# Altium schematic sheet Block Diagram.SchDoc
size 420 x 297 mm; DrawnBy: Süleyman ARIKAYA; Revision: AA; SheetNumber: 2; SheetTotal: 5
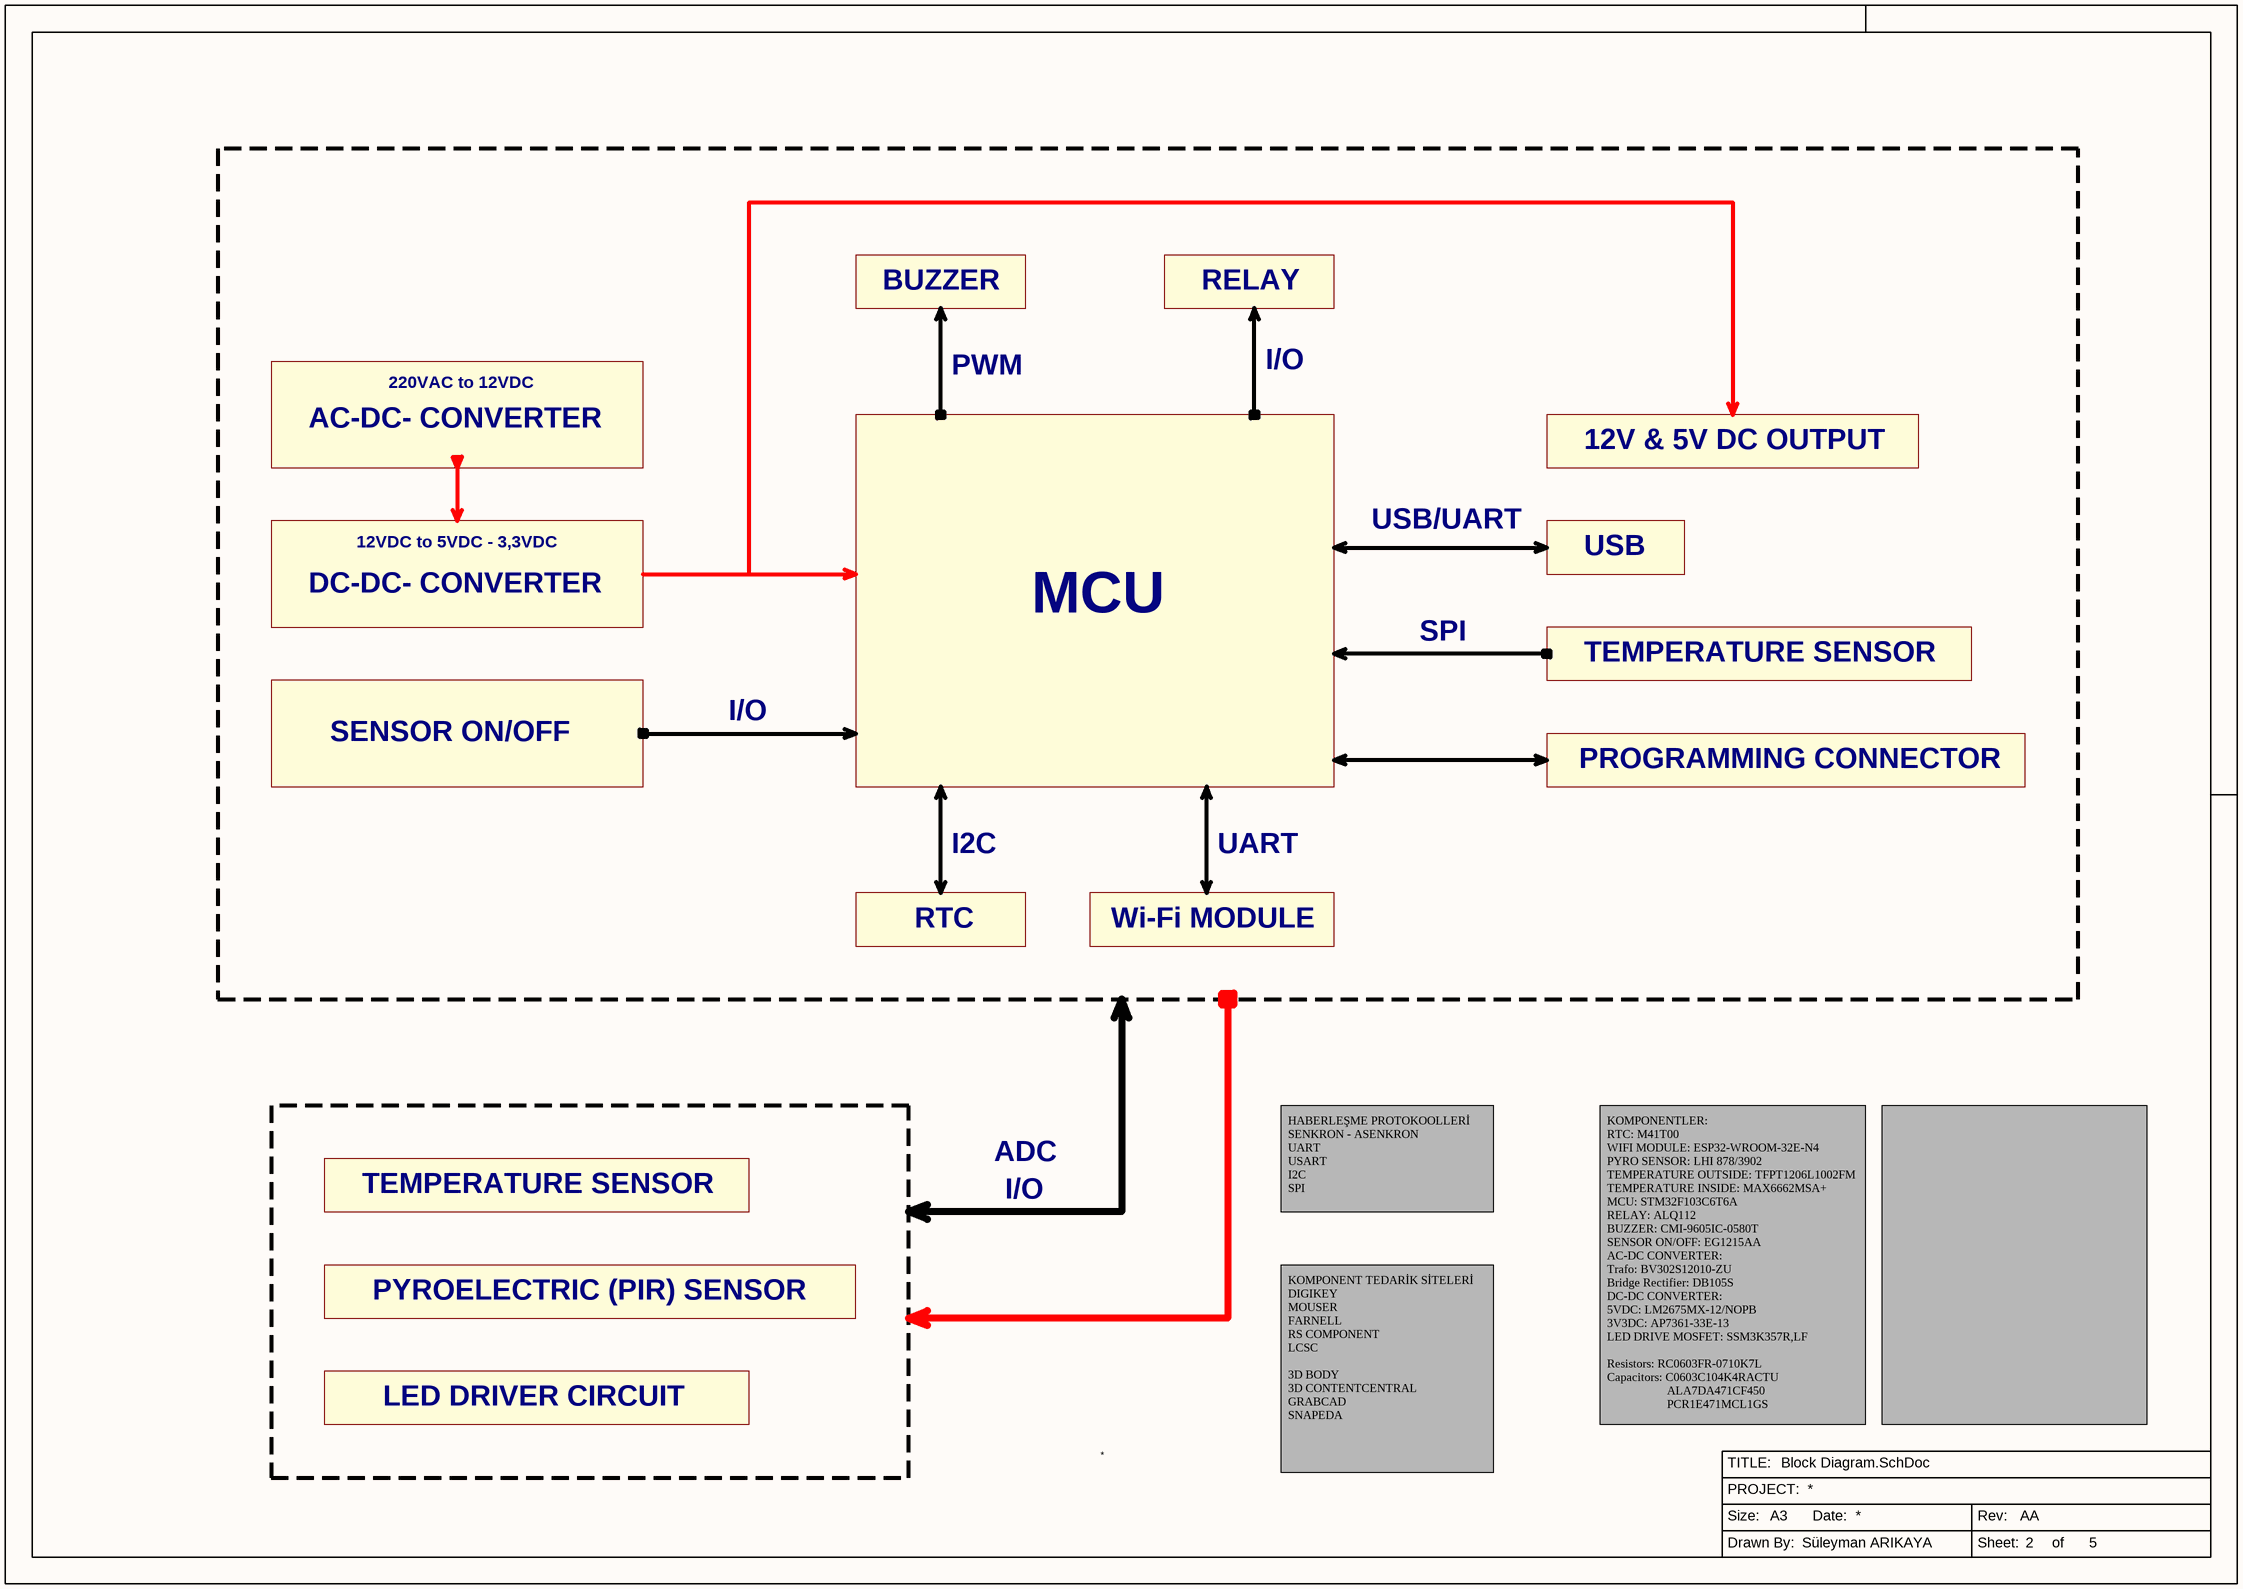
[diagram p0: Block Diagram.SchDoc]

## Notes on the sheet
- BUZZER
- RELAY
- 220VAC to 12VDC
- PWM
- I/O
- AC-DC- CONVERTER
- 12V & 5V DC OUTPUT
- USB/UART
- DC-DC- CONVERTER
- 12VDC to 5VDC - 3,3VDC
- USB
- MCU
- SPI
- TEMPERATURE SENSOR
- SENSOR ON/OFF
- PROGRAMMING CONNECTOR
- I2C
- UART
- RTC
- Wi-Fi MODULE
- ADC
- HABERLEŞME PROTOKOOLLERİ
  SENKRON - ASENKRON
  UART
  USART
  I2C
  SPI
- PYROELECTRIC (PIR) SENSOR
- LED DRIVER CIRCUIT
- KOMPONENT TEDARİK SİTELERİ
  DIGIKEY
  MOUSER
  FARNELL
  RS COMPONENT
  LCSC
  3D BODY
  3D CONTENTCENTRAL
  GRABCAD
  SNAPEDA
- KOMPONENTLER:
  RTC: M41T00
  WIFI MODULE: ESP32-WROOM-32E-N4
  PYRO SENSOR: LHI 878/3902
  TEMPERATURE OUTSIDE: TFPT1206L1002FM
  TEMPERATURE INSIDE: MAX6662MSA+
  MCU: STM32F103C6T6A
  RELAY: ALQ112
  BUZZER: CMI-9605IC-0580T
  SENSOR ON/OFF: EG1215AA
  AC-DC CONVERTER:
  Trafo: BV302S12010-ZU
  Bridge Rectifier: DB105S
  DC-DC CONVERTER:
  5VDC: LM2675MX-12/NOPB
  3V3DC: AP7361-33E-13
  LED DRIVE MOSFET: SSM3K357R,LF
  Resistors: RC0603FR-0710K7L
  Capacitors: C0603C104K4RACTU
  ALA7DA471CF450
  PCR1E471MCL1GS
- TITLE:
- PROJECT:
- Size:
- A3
- Date:
- Rev:
- Drawn By:
- Süleyman ARIKAYA
- Sheet:
- of